# Altium schematic sheet USBPWR_SWITCH_AP21x1.SchDoc
size A3
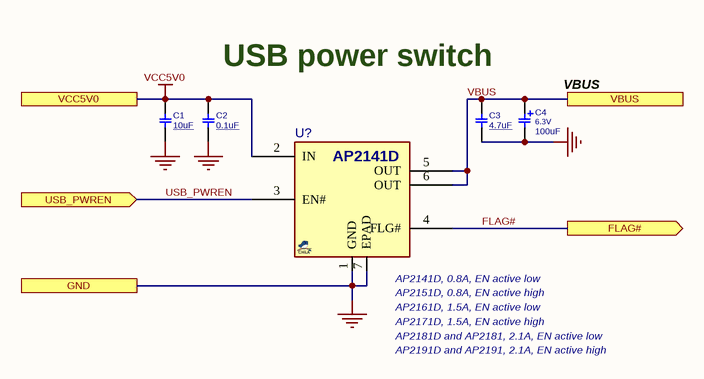
[diagram p0: USBPWR_SWITCH_AP21x1.SchDoc]

## Parts
C1  10uF  [C0603]
C2  0.1uF  [C0402]
C3  4.7uF  [C0402]
C4  PARAM2: 6.3V  [C_TN_3528]  (hidden comment: 100uF)
U?  AP2141D  [SON50_6T_2018]  (value not drawn)

## Ports
FLAG# (out), GND, USB_PWREN (in), VBUS, VCC5V0

## Nets
GND: C1.2 C2.2 C3.1 C4.2 U?.1(GND) U?.7(EPAD) ; port GND
VCC5V0: C1.1 C2.1 U?.2(IN) ; port VCC5V0
FLAG#: U?.4(FLG#) ; port FLAG#
USB_PWREN: U?.3(EN#) ; port USB_PWREN
VBUS: C3.2 C4.1 U?.5(OUT) U?.6(OUT) ; port VBUS

## Notes on the sheet
- USB power switch
- (near C4) VBUS
- (near U?) AP2141D, 0.8A, EN active low
- (near U?) AP2151D, 0.8A, EN active high
- (near U?) AP2161D, 1.5A, EN active low
- AP2171D, 1.5A, EN active high
- AP2181D and AP2181, 2.1A, EN active low
- AP2191D and AP2191, 2.1A, EN active high

## Library data of the parts
C1 = CAP_SMD_MLCC: C0402, MLCC, 10uF, 25V; PARAM: X5R; MANF: Murata; PARAM2: 10V; PRICE: -; DESC: -; MANF_P#: -; ASSEMBLY: ASSEMBLY; VALUE: 10uF
C2 = CAP_SMD_MLCC: C0402, MLCC, 100nF, 25V; PARAM: C0G, 10%; MANF: Murata; PARAM2: 50V; PRICE: 100= 1.4$; DESC: -; MANF_P#: -; ASSEMBLY: ASSEMBLY; VALUE: 0.1uF
C3 = CAP_SMD_MLCC: C0402, MLCC, 4.7uF, 25V; PARAM: C0G, 10%; MANF: Murata; PARAM2: 50V; PRICE: 100= 1.4$; DESC: -; MANF_P#: -; ASSEMBLY: ASSEMBLY; VALUE: 4.7uF
C4 = CAP_SMD_TAN_3528: CAP, SMD, TAN,; VALUE: 100uF
U? = AP2141D_SON6: LOAD SW, 5V USB, 0.8A, 2.7~5.5V, 90mOhm; MANF: Diodes; MANF_P#: AP2141DFMG-7; PARAM: 0.8A, 90mOhm; PARAM2: 2.7~5.5V; PRICE: 0.4$; VALUE: AP2141D